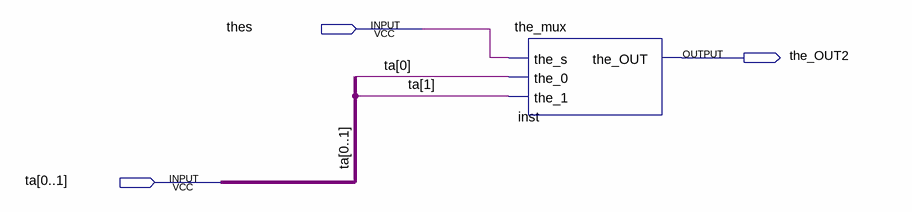
[diagram p0: schematic sheet]
// Quartus schematic my_mux2.bdf as structural Verilog: 1 symbols, 3 pins
module my_mux2 (
  input  thes,
  input  [0:1] ta,
  output the_OUT2
);

  the_mux inst (.the_s(thes), .the_0(ta[0]), .the_1(ta[1]), .the_OUT(the_OUT2));
endmodule
